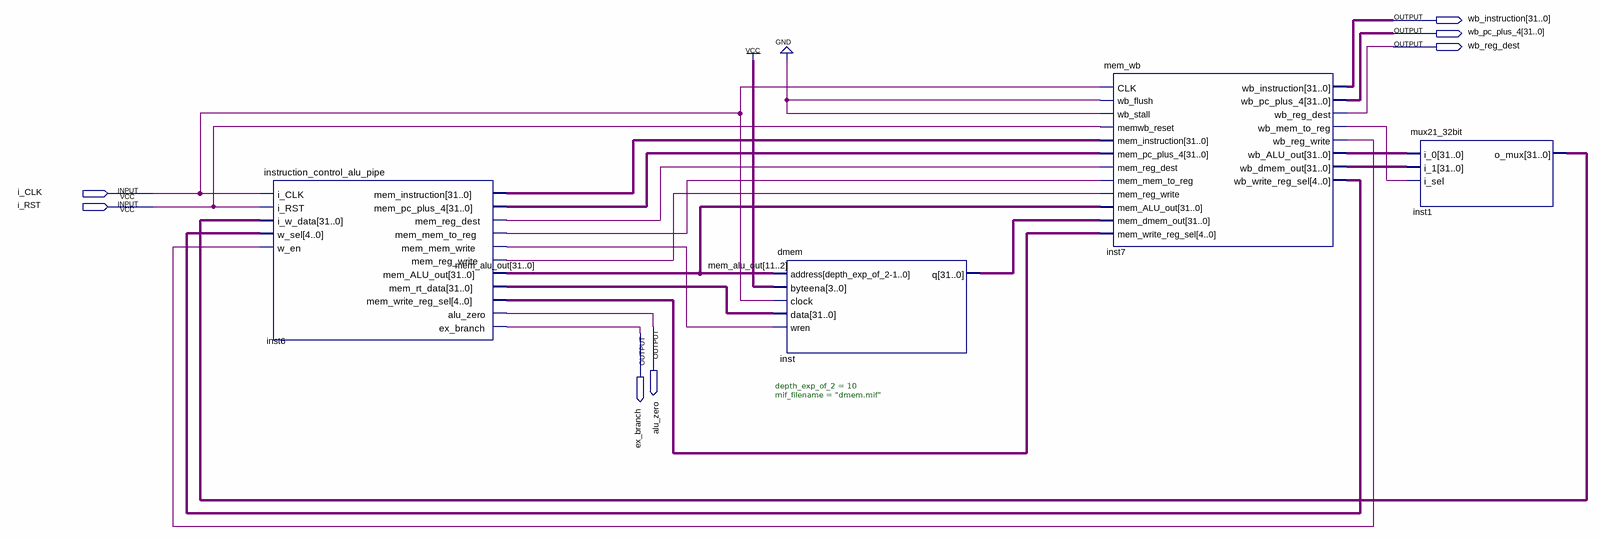
[diagram p0: schematic sheet]
// Quartus schematic project_b.bdf as structural Verilog: 4 symbols, 7 pins
module project_b (
  input  i_CLK,
  input  i_RST,
  output [31:0] wb_instruction,
  output [31:0] wb_pc_plus_4,
  output wb_reg_dest,
  output alu_zero,
  output ex_branch
);

  wire inst6_mem_mem_to_reg, inst6_mem_mem_write, inst6_mem_reg_dest, inst6_mem_reg_write,
       inst7_wb_mem_to_reg, inst7_wb_reg_write;
  wire [4:0] inst6_mem_write_reg_sel, inst7_wb_write_reg_sel;
  wire [31:0] inst1_o_mux, inst6_mem_instruction, inst6_mem_pc_plus_4, inst6_mem_rt_data, inst7_wb_alu_out,
       inst7_wb_dmem_out, inst_q, mem_alu_out;

  instruction_control_alu_pipe inst6 (
    .i_CLK(i_CLK), .i_RST(i_RST), .i_w_data(inst1_o_mux), .w_sel(inst7_wb_write_reg_sel),
    .w_en(inst7_wb_reg_write), .mem_instruction(inst6_mem_instruction), .mem_pc_plus_4(inst6_mem_pc_plus_4),
    .mem_reg_dest(inst6_mem_reg_dest), .mem_mem_to_reg(inst6_mem_mem_to_reg),
    .mem_mem_write(inst6_mem_mem_write), .mem_reg_write(inst6_mem_reg_write), .mem_ALU_out(mem_alu_out),
    .mem_rt_data(inst6_mem_rt_data), .mem_write_reg_sel(inst6_mem_write_reg_sel), .alu_zero(alu_zero),
    .ex_branch(ex_branch));
  dmem #(.depth_exp_of_2(10), .mif_filename("dmem.mif")) inst (
    .address(mem_alu_out[11:2]), .byteena(4'b1111), .clock(i_CLK), .data(inst6_mem_rt_data),
    .wren(inst6_mem_mem_write), .q(inst_q));
  mem_wb inst7 (
    .CLK(i_CLK), .wb_flush(1'b0), .wb_stall(1'b0), .memwb_reset(i_RST),
    .mem_instruction(inst6_mem_instruction), .mem_pc_plus_4(inst6_mem_pc_plus_4),
    .mem_reg_dest(inst6_mem_reg_dest), .mem_mem_to_reg(inst6_mem_mem_to_reg),
    .mem_reg_write(inst6_mem_reg_write), .mem_ALU_out(mem_alu_out), .mem_dmem_out(inst_q),
    .mem_write_reg_sel(inst6_mem_write_reg_sel), .wb_instruction(wb_instruction),
    .wb_pc_plus_4(wb_pc_plus_4), .wb_reg_dest(wb_reg_dest), .wb_mem_to_reg(inst7_wb_mem_to_reg),
    .wb_reg_write(inst7_wb_reg_write), .wb_ALU_out(inst7_wb_alu_out), .wb_dmem_out(inst7_wb_dmem_out),
    .wb_write_reg_sel(inst7_wb_write_reg_sel));
  mux21_32bit inst1 (.i_0(inst7_wb_alu_out), .i_1(inst7_wb_dmem_out), .i_sel(inst7_wb_mem_to_reg), .o_mux(inst1_o_mux));
endmodule
